# Altium schematic sheet Sheet1.SchDoc
size A4
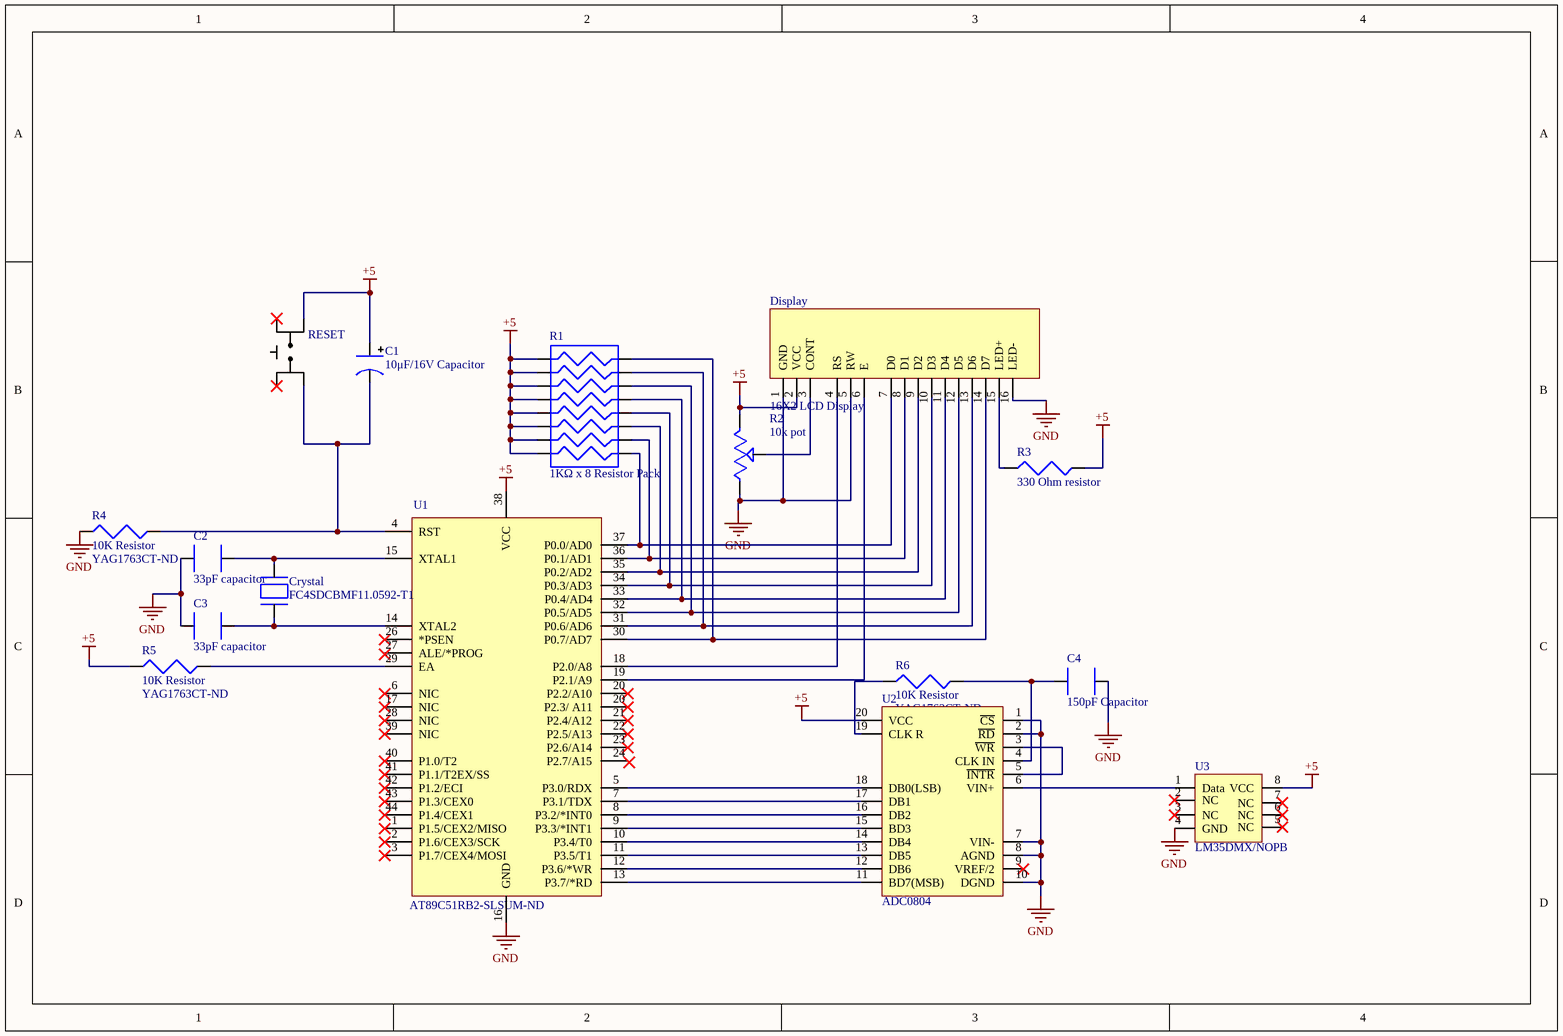
[diagram p0: Sheet1.SchDoc]

## Parts
C1  10μF/16V Capacitor  [10µf/16v Capacitor]
C2  33pF capacitor  [33pF Capacitor]
C3  33pF capacitor  [33pF Capacitor]
C4  150pF Capacitor  [150pF Capacitor]
Crystal  FC4SDCBMF11.0592-T1  [Crystal 11.0592MHz]
Display  16X2 LCD Display  [16X2 LCD Display]
R1  1KΩ x 8 Resistor Pack  [1KO x 8 Resistor Pack]
R2  10k pot  [10k pot]
R3  330 Ohm resistor  [330O Resistor]
R4  10K Resistor  Supplier Part Number 1: YAG1763CT-ND  [10KO Resistor]
R5  10K Resistor  Supplier Part Number 1: YAG1763CT-ND  [10KO Resistor]
R6  10K Resistor  Supplier Part Number 1: YAG1763CT-ND  [10KO Resistor]
RESET  TL3305AF260QG  [Reset]  (value not drawn)
U1  Supplier Part Number 1: AT89C51RB2-SLSUM-ND  [AT89C51 (8051 Microcontroller)]  (hidden comment: AT89C51RB2-SLSUM)
U2  ADC0804  [ADC0804]
U3  LM35DMX/NOPB  [LM35DMX]

## Nets
+5: C1.1 Display.2(VCC) R1.1 R1.2 R1.3 R1.4 R1.5 R1.6 R1.7 R1.8 R2.2 R3.2 R5.1 RESET.3 U1.38(VCC) U2.20(VCC) U3.8(VCC)
GND: C2.1 C3.1 C4.2 Display.1(GND) Display.5(RW) Display.16(LED-) R2.1 R4.1 U1.16(GND) U2.1(~{CS}) U2.2(~{RD}) U2.7(VIN-) U2.8(AGND) U2.10(DGND) U3.4(GND)
NetC1_2: C1.2 R4.2 RESET.2 U1.4(RST)
NetC2_2: C2.2 Crystal.2 U1.15(XTAL1)
NetC3_2: C3.2 Crystal.1 U1.14(XTAL2)
NetC4_1: C4.1 R6.2 U2.4(CLK_IN)
NetDisplay_3: Display.3(CONT) R2.3
NetDisplay_4: Display.4(RS) U1.18(P2.0/A8)
NetDisplay_6: Display.6(E) U1.19(P2.1/A9)
NetDisplay_7: Display.7(D0) R1.9 U1.37(P0.0/AD0)
NetDisplay_8: Display.8(D1) R1.10 U1.36(P0.1/AD1)
NetDisplay_9: Display.9(D2) R1.11 U1.35(P0.2/AD2)
NetDisplay_10: Display.10(D3) R1.12 U1.34(P0.3/AD3)
NetDisplay_11: Display.11(D4) R1.13 U1.33(P0.4/AD4)
NetDisplay_12: Display.12(D5) R1.14 U1.32(P0.5/AD5)
NetDisplay_13: Display.13(D6) R1.15 U1.31(P0.6/AD6)
NetDisplay_14: Display.14(D7) R1.16 U1.30(P0.7/AD7)
NetDisplay_15: Display.15(LED+) R3.1
NetR5_2: R5.2 U1.29(EA)
NetR6_1: R6.1 U2.19(CLK_R)
NetU1_5: U1.5(P3.0/RDX) U2.18(DB0(LSB))
NetU1_7: U1.7(P3.1/TDX) U2.17(DB1)
NetU1_8: U1.8(P3.2/*INT0) U2.16(DB2)
NetU1_9: U1.9(P3.3/*INT1) U2.15(BD3)
NetU1_10: U1.10(P3.4/T0) U2.14(DB4)
NetU1_11: U1.11(P3.5/T1) U2.13(DB5)
NetU1_12: U1.12(P3.6/*WR) U2.12(DB6)
NetU1_13: U1.13(P3.7/*RD) U2.11(BD7(MSB))
NetU2_3: U2.3(~{WR}) U2.5(~{INTR})
NetU2_6: U2.6(VIN+) U3.1(Data)

Not connected (* = marked no-connect by the designer): RESET 1* 4*; U1 1(P1.5/CEX2/MISO)* 2(P1.6/CEX3/SCK)* 3(P1.7/CEX4/MOSI)* 6(NIC)* 17(NIC)* 20(P2.2/A10)* 21(P2.4/A12)* 22(P2.5/A13)* 23(P2.6/A14)* 24(P2.7/A15) 26(*PSEN)* 27(ALE/*PROG) 28(NIC)* 39(NIC)* 40(P1.0/T2)* 41(P1.1/T2EX/SS)* 42(P1.2/ECI)* 43(P1.3/CEX0)* 44(P1.4/CEX1)*; U2 9(VREF/2)*; U3 2(NC)* 3(NC)* 5(NC)* 6(NC)* 7(NC)*

## Library data of the parts
C1 = 10μF/16V Capacitor: Multilayer Ceramic Capacitors MLCC - SMD/SMT 10uF 16V X5R 10%; Manufacturer: Yageo; Manufacturer Part Number: CC0805KKX5R7BB106; Supplier 1: Digi-Key; RoHS: Yes; Category: Ceramic Capacitors; Stock 1: 725165; Pricing 1: 1=0.40000, 10=0.27500, 50=0.19240, 100=0.16500, 500=0.12376, 1000=0.10450 (USD); Mount: Surface Mount; Case/Package: 0805; Case Code (Imperial): 0805; Case Code (Metric): 2012; Weight: 0.000194oz; Min Operating Temperature: -55°C; Max Operating Temperature: 85°C; Capacitance: 10uF; Tolerance: 10%; Dielectric: X5R; Voltage Rating (DC): 16V; Packaging: Tape and Reel; Voltage Rating: 16V; Termination: SMD/SMT; Resistor Type: Ceramic; Series: CC; Construction: Flat; Length: 2mm; Width: 0.049inch; Height: 1.25mm; Thickness: 0.057inch; Depth: 1.25mm; Radiation Hardening: No; Lead Free: Lead Free; Halogen Free: Halogen Free; RoHS Compliant: Yes; ComponentLink1URL: https://datasheet.ciiva.com/17434/upy-gphc-x5r-4v-to-50v-12-17434747.pdf?src-supplier=Avnet+Europe; ComponentLink1Description: https://datasheet.ciiva.com/17434/upy-gphc-x5r-4v-to-50v-12-17434747.pdf?src-supplier=Avnet+Europe; Supplier Part Number 1: 311-1865-1-ND
C2 C3 = smd 33pF capacitor: Cap Ceramic 33pF 50V C0G 5% SMD 0402 125C Paper T/R; Manufacturer: Samsung; Manufacturer Part Number: CL05C330JB5NNNC; Temperature Coefficient: 300ppm/°C; Supplier 1: Digi-Key; RoHS: Yes; Category: Ceramic Capacitors; Stock 1: 8625103; Pricing 1: 1=0.10000, 10=0.02500, 50=0.01360, 100=0.01120, 500=0.00796, 1000=0.00626, 2500=0.00569, 5000=0.00524 (USD); Mount: Surface Mount; Case/Package: 0402; Case Code (Metric): 1005; Case Code (Imperial): 0402; Material: Ceramic; Contact Plating: Tin; Min Operating Temperature: -55°C; Max Operating Temperature: 125°C; Package Quantity: 1; Packaging: Tape and Reel; Capacitance: 33pF; Tolerance: 5%; Voltage Rating: 50V; Dielectric: C0G; Voltage: 50V; Voltage Rating (DC): 50V; Series: CL; Construction: Flat; Length: 1mm; Width: 0.02inch; Height: 0.5mm; Thickness: 0.022inch; Depth: 0.5mm; Radiation Hardening: No; Lead Free: Lead Free; RoHS Compliant: Yes; ComponentLink1URL: https://datasheet.ciiva.com/15195/getdatasheetpartid-355282-15195687.pdf?src-supplier=Verical; ComponentLink1Description: https://datasheet.ciiva.com/15195/getdatasheetpartid-355282-15195687.pdf?src-supplier=Verical; ComponentLink2URL: https://datasheet.ciiva.com/29198/458594-da-01-en-vs-kondensator-0402-29198402.pdf?src-supplier=Conrad; ComponentLink2Description: https://datasheet.ciiva.com/29198/458594-da-01-en-vs-kondensator-0402-29198402.pdf?src-supplier=Conrad; Supplier Part Number 1: 1276-1272-1-ND
C4 = 150pF Capacitor: CAP CER 150PF 250V NPO 0603; Manufacturer: Yageo; Manufacturer Part Number: AC0603JRNPOYBN151; Supplier 1: Digi-Key; RoHS: Yes; Stock 1: 20564; Pricing 1: 1=0.20000, 10=0.13300, 50=0.07980, 100=0.06740, 500=0.04610, 1000=0.04078 (USD); RoHS Compliant: Yes; ComponentLink1URL: http://www.yageo.com/NewPortal/_en/search/productDocs.jsp?YageoPartNumber=AC0603JRNPOYBN151&src-supplier=Digi-Key; ComponentLink1Description: http://www.yageo.com/NewPortal/_en/search/productDocs.jsp?YageoPartNumber=AC0603JRNPOYBN151&src-supplier=Digi-Key; Supplier Part Number 1: 311-3283-1-ND
Crystal = FC4SDCBMF11.0592-T1: Crystal 11.0592MHz ±30ppm (Tol) ±50ppm (Stability) 20pF FUND 60Ohm 2-Pin HC-49/SDLF SMD T/R; Manufacturer: Fox Electronics; Supplier 1: Digi-Key; Manufacturer Part Number: FC4SDCBMF11.0592-T1; RoHS: Yes; Stock 1: 29569; Pricing 1: 1=0.29000, 10=0.23900, 50=0.21500, 100=0.19110, 500=0.18154 (USD); ComponentLink1URL: http://www.foxonline.com/pdfs/C4SD.pdf?src-supplier=Digi-Key; ComponentLink1Description: http://www.foxonline.com/pdfs/C4SD.pdf?src-supplier=Digi-Key; Supplier Part Number 1: 631-1012-1-ND
Display = 16X2 LCD Display: LCD Graphic Display Modules & Accessories FSTN (+) 80.0 x 36.0; Manufacturer: Newhaven Display; Manufacturer Part Number: NHD-14432WG-BTFH-V#T; Background Color: White; Resolution (height): 32pixel; Resolution (width): 144pixel; Backlight Type: LED; Interface: Parallel; Supplier 1: Digi-Key; RoHS: No; Category: LCD, OLED, Graphic Displays; Stock 1: 163; Pricing 1: 1=18.55000, 5=17.43200, 10=16.56400 (USD); Min Operating Temperature: -20°C; Max Operating Temperature: 70°C; Packaging: Bulk; Package Quantity: 100; ComponentLink1URL: https://datasheet.ciiva.com/5326/nhd-14432wg-btfh-vt-17058-5326579.pdf?src-supplier=Mouser; ComponentLink1Description: https://datasheet.ciiva.com/5326/nhd-14432wg-btfh-vt-17058-5326579.pdf?src-supplier=Mouser; ComponentLink2URL: https://datasheet.ciiva.com/15047/nhd-14432wg-btfh-vt-15047133.pdf?src-supplier=Digi-Key; ComponentLink2Description: https://datasheet.ciiva.com/15047/nhd-14432wg-btfh-vt-15047133.pdf?src-supplier=Digi-Key; Supplier Part Number 1: NHD-14432WG-BTFH-V#T-ND
R1 = 1KΩ x 8 Resistor Pack: RES ARRAY 8 RES 1K OHM 16SOIC; Manufacturer: Vishay Dale Thin Film; Manufacturer Part Number: NOMCT16031001AT1; Number of Terminals/Pins: 16; Voltage Rating: 100V; Resistance: 1kR; Tolerance: 0.1%; Circuit Type: Isolated; Number of Resistors: 8; Power Per Element: 100mW; Temperature Coefficient: 25ppm/°C; Supplier 1: Digi-Key; RoHS: Yes; Category: Resistor Arrays; Stock 1: 8459; Pricing 1: 1=4.16000, 10=3.76000, 25=3.44000, 50=3.20000, 100=2.80000, 250=2.40000, 500=2.20000 (USD); Mount: Surface Mount; Case/Package: SOIC; Number of Pins: 16; Contact Plating: Tin,Matte; Min Operating Temperature: -55°C; Max Operating Temperature: 125°C; Package Quantity: 1; Packaging: Tape and Reel; Termination: SMD/SMT; Power Rating: 100mW; Series: NOMC; Length: 9.906mm; Width: 0.154inch; Height: 0.063inch; Lead Pitch: 1.27mm; Terminal Pitch: 1.27mm; Lead Free: Lead Free; RoHS Compliant: Yes; ComponentLink1URL: https://datasheet.ciiva.com/2692/nomc-2692947.pdf?src-supplier=Digi-Key; ComponentLink1Description: https://datasheet.ciiva.com/2692/nomc-2692947.pdf?src-supplier=Digi-Key; ComponentLink2URL: https://datasheet.ciiva.com/2692/nomc-2692948.pdf?src-supplier=Digi-Key; ComponentLink2Description: https://datasheet.ciiva.com/2692/nomc-2692948.pdf?src-supplier=Digi-Key; ComponentLink3URL: https://datasheet.ciiva.com/2692/nomc-2692949.pdf?src-supplier=Digi-Key; ComponentLink3Description: https://datasheet.ciiva.com/2692/nomc-2692949.pdf?src-supplier=Digi-Key; Supplier Part Number 1: NOMCT16-1KACT-ND
R2 = 10k pot: Res POT 10K Ohm 20% 1/20W 1(Elec)/1(Mech)Turn 6mm (25.7 X 12.1 X 14.85mm) Pin Panel Mount/Bracket Mount Tray; Manufacturer: Alps Electric; Manufacturer Part Number: RK09L1120A2S; Resistance: 10kR; Power Rating: 50mW; Number of Turns: 1; Hole Diameter: 9mm; Supplier 1: Mouser; RoHS: Yes; Category: Variable Resistors and Potentiometers; Stock 1: 3989; Pricing 1: 1=1.38000, 10=1.38000, 50=1.14000, 100=1.10000, 1000=0.99900, 10000=0.95000 (USD); Mount: Panel,Brackets,Through Hole; Min Operating Temperature: -10°C; Max Operating Temperature: 70°C; Tolerance: 20%; Type: Potentiometer; Packaging: Tray; Package Quantity: 2000; Resistor Type: Potentiometer; Termination: Pin; Series: RK09L; Length: 25.7mm; Depth: 12.1mm; Radiation Hardening: No; Military Standard: Not; Lead Free: Lead Free; RoHS Compliant: Yes; ComponentLink1URL: https://datasheet.ciiva.com/15764/rk09l-15764032.pdf?src-supplier=Onlinecomponents.com; ComponentLink1Description: https://datasheet.ciiva.com/15764/rk09l-15764032.pdf?src-supplier=Onlinecomponents.com; ComponentLink2URL: https://datasheet.ciiva.com/11830/0900766b80f4c570-11830918.pdf?src-supplier=RSComponents; ComponentLink2Description: https://datasheet.ciiva.com/11830/0900766b80f4c570-11830918.pdf?src-supplier=RSComponents; Supplier Part Number 1: 688-RK09L1120A2S
R3 = 0805SMD 330resistor: YAGEO   RC0805JR-07330RL   THICK FILM RESISTOR, 330 OHM, 125mW, 5%, FULL REEL; Manufacturer Part Number: RL0805FR-7W0R33L; Resistance: 330mR; Tolerance: 1%; Voltage Rating: 150V; Temperature Coefficient: 600ppm/°C; Max Power Dissipation: 250mW; Supplier 1: Digi-Key; Manufacturer: Yageo; RoHS: Yes; Category: Chip SMD Resistors; Stock 1: 7620; Pricing 1: 1=0.42000, 10=0.32300, 100=0.13570, 1000=0.07490, 2500=0.07022 (USD); Case/Package: 0805; Case Code (Imperial): 0805; Case Code (Metric): 2012; Weight: 0.000194oz; Min Operating Temperature: -55°C; Max Operating Temperature: 125°C; Packaging: Tape and Reel; Power Rating: 125mW; Resistor Type: Thick Film; Termination: SMD/SMT; Package Quantity: 5000; Features: Moisture Resistant,Automotive AEC-Q200; Series: RL; Number of Terminations: 2; Technology: THICK FILM; Construction: Rectangular; Resistance Tolerance: 1%; Length: 2mm; Width: 1.25mm; Height: 0.5mm; Depth: 1.25mm; REACH SVHC: Unknown; Military Standard: Not; Lead Free: Lead Free; RoHS Compliant: Yes; ComponentLink1URL: https://datasheet.ciiva.com/14972/rl20high20power20series-14972688.pdf?src-supplier=Digi-Key; ComponentLink1Description: https://datasheet.ciiva.com/14972/rl20high20power20series-14972688.pdf?src-supplier=Digi-Key; ComponentLink2URL: https://datasheet.ciiva.com/7942/1693483-7942062.pdf?src-supplier=Element14; ComponentLink2Description: https://datasheet.ciiva.com/7942/1693483-7942062.pdf?src-supplier=Element14; ComponentLink3URL: https://datasheet.ciiva.com/7942/1693483-7942063.pdf?src-supplier=Element14; ComponentLink3Description: https://datasheet.ciiva.com/7942/1693483-7942063.pdf?src-supplier=Element14; Supplier Part Number 1: 311-.33LUCT-ND; Supplier 2: Digi-Key; Stock 2: 1073130; Pricing 2: 1=0.10000, 10=0.03100, 100=0.01260, 1000=0.00567, 2500=0.00492 (USD); Contact Plating: Tin,Matte,Lead; Size Code: 0805; Radiation Hardening: No; ComponentLink4URL: https://datasheet.ciiva.com/17008/rc0805-17008395.pdf?src-supplier=Future+Electronics; ComponentLink4Description: https://datasheet.ciiva.com/17008/rc0805-17008395.pdf?src-supplier=Future+Electronics; ComponentLink5URL: https://datasheet.ciiva.com/46395/444164-46395119.pdf?src-supplier=Element14; ComponentLink5Description: https://datasheet.ciiva.com/46395/444164-46395119.pdf?src-supplier=Element14; ComponentLink6URL: https://datasheet.ciiva.com/7941/442941-7941941.pdf?src-supplier=Element14; ComponentLink6Description: https://datasheet.ciiva.com/7941/442941-7941941.pdf?src-supplier=Element14; ComponentLink7URL: https://datasheet.ciiva.com/7941/442941-7941942.pdf?src-supplier=Element14; ComponentLink7Description: https://datasheet.ciiva.com/7941/442941-7941942.pdf?src-supplier=Element14; ComponentLink8URL: https://datasheet.ciiva.com/12555/rc0805-257173-12555078.pdf?src-supplier=Mouser; ComponentLink8Description: https://datasheet.ciiva.com/12555/rc0805-257173-12555078.pdf?src-supplier=Mouser; Supplier Part Number 2: 311-330ARCT-ND
R4-R6 = 0805 SMD 10k resistor: Supplier 1: Digi-Key
RESET = TL3305AF260QG: Tactile Switches 6mm SMT Gull Wing 5mm Act Height; Manufacturer: E-Switch; Mechanical Life: 200000Cycles; Throw Configuration: SPST; Illumination Type: Non-Illuminated; Operating Force: 260gf; Switch Function: Off-Mom; Actuator Type: Standard; Switch Travel: 0.2mm; Actuator Material: Nylon,Polyamide; Voltage Rating (DC): 12V; Current Rating: 50mA; Contact Resistance: 100mR; Max Voltage Rating (DC): 50V; Electrical Life: 100000Cycles; Actuator Length: 1.4mm; Supplier 1: Digi-Key; Manufacturer Part Number: TL3305AF260QG; RoHS: No; Category: Tactile Switches; Stock 1: 78497; Pricing 1: 1=0.18000, 10=0.17700, 25=0.16760, 100=0.15250, 250=0.14336, 500=0.13116, 1000=0.10980 (USD); Mount: Surface Mount; Min Operating Temperature: -20°C; Max Operating Temperature: 70°C; Packaging: Tape and Reel; Termination: Gull Wing; Lead Free: Lead Free; ComponentLink1URL: http://www.farnell.com/datasheets/2554191.pdf?src-supplier=Farnell; ComponentLink1Description: http://www.farnell.com/datasheets/2554191.pdf?src-supplier=Farnell; ComponentLink2URL: http://spec_sheets.e-switch.com/specs/P010471.pdf?src-supplier=Mouser; ComponentLink2Description: http://spec_sheets.e-switch.com/specs/P010471.pdf?src-supplier=Mouser; ComponentLink3URL: http://www.farnell.com/datasheets/2554191.pdf?src-supplier=Newark; ComponentLink3Description: http://www.farnell.com/datasheets/2554191.pdf?src-supplier=Newark; ComponentLink4URL: http://www.farnell.com/datasheets/2554191.pdf?src-supplier=Element14; ComponentLink4Description: http://www.farnell.com/datasheets/2554191.pdf?src-supplier=Element14; ComponentLink5URL: http://spec_sheets.e-switch.com/specs/P010471.pdf?src-supplier=Digi-Key; ComponentLink5Description: http://spec_sheets.e-switch.com/specs/P010471.pdf?src-supplier=Digi-Key; ComponentLink6URL: http://spec_sheets.e-switch.com/specs/P010471.pdf?src-supplier=NAC+Semi; ComponentLink6Description: http://spec_sheets.e-switch.com/specs/P010471.pdf?src-supplier=NAC+Semi; Supplier Part Number 1: EG5353CT-ND; Supplier 2: Digi-Key; Stock 2: 51540; Pricing 2: 1=0.36000, 10=0.34800, 25=0.32760, 100=0.28440, 250=0.25800, 500=0.24000 (USD); Contact Plating: Silver; Contact Material: Silver; Package Quantity: 1000; Orientation: Straight; Series: TL3301; Voltage Rating: 50V; Insulation Resistance: 100MR; RoHS Compliant: Yes; REACH SVHC: No SVHC; ComponentLink7URL: https://datasheet.ciiva.com/2900/p010516d-2900775.pdf?src-supplier=Digi-Key; ComponentLink7Description: https://datasheet.ciiva.com/2900/p010516d-2900775.pdf?src-supplier=Digi-Key; ComponentLink8URL: https://datasheet.ciiva.com/7637/tl3301-7637656.pdf?src-supplier=Element14; ComponentLink8Description: https://datasheet.ciiva.com/7637/tl3301-7637656.pdf?src-supplier=Element14; ComponentLink9URL: https://datasheet.ciiva.com/2900/tl3301-2900776.pdf?src-supplier=Digi-Key; ComponentLink9Description: https://datasheet.ciiva.com/2900/tl3301-2900776.pdf?src-supplier=Digi-Key; Supplier Part Number 2: EG2526CT-ND
U1 = AT89C51RB2-SLSUM: MCU 8-bit AT89 80C51 CISC 32KB Flash 3.3V/5V 44-Pin VQFP Tray; Manufacturer: Microchip / Atmel; Core Architecture: 8051; Interface: SPI,UART,USART; Peripherals: POR,PWM,WDT; RAM Size: 1.25KB; Max Power Dissipation: 1W; Number of I/Os: 32; Number of Timers/Counters: 3; Watchdog Timer: Yes; Max Supply Voltage: 5.5V; Min Supply Voltage: 2.7V; Frequency: 60MHz; Memory Size: 16KB; Oscillator Type: External; Data Bus Width: 8b; Access Time: 60us; Supplier 1: Digi-Key; Manufacturer Part Number: AT89C51RB2-SLSUM; RoHS: Yes; Category: Microcontrollers; Stock 1: 4189; Pricing 1: 1=5.21000, 25=4.78000, 100=4.33000 (USD); Mount: Surface Mount; Case/Package: PLCC; Number of Pins: 44; Contact Plating: Tin,Matte; Min Operating Temperature: -40°C; Max Operating Temperature: 85°C; Package Quantity: 972; Packaging: Rail/Tube; Memory Type: FLASH; Number of Programmable I/O: 32; Max Frequency: 60MHz; Address Bus Width: 8b; Radiation Hardening: No; Lead Free: Lead Free; REACH SVHC: No SVHC; ComponentLink1URL: https://datasheet.ciiva.com/15122/getdatasheetpartid-81444-15122117.pdf?src-supplier=Verical; ComponentLink1Description: https://datasheet.ciiva.com/15122/getdatasheetpartid-81444-15122117.pdf?src-supplier=Verical; ComponentLink2URL: https://datasheet.ciiva.com/26820/at89c51rb2-slsum-26820400.pdf?src-supplier=IIIC; ComponentLink2Description: https://datasheet.ciiva.com/26820/at89c51rb2-slsum-26820400.pdf?src-supplier=IIIC; ComponentLink3URL: https://datasheet.ciiva.com/24153/doc4180-24153718.pdf?src-supplier=Future+Electronics; ComponentLink3Description: https://datasheet.ciiva.com/24153/doc4180-24153718.pdf?src-supplier=Future+Electronics; ComponentLink4URL: https://datasheet.ciiva.com/3203/doc4180-3203035.pdf?src-supplier=Avnet; ComponentLink4Description: https://datasheet.ciiva.com/3203/doc4180-3203035.pdf?src-supplier=Avnet; ComponentLink5URL: https://datasheet.ciiva.com/22640/1626853-22640219.pdf?src-supplier=Element14; ComponentLink5Description: https://datasheet.ciiva.com/22640/1626853-22640219.pdf?src-supplier=Element14; Stock 2: 1379; Pricing 2: 1=5.95000, 25=5.46000, 100=4.95000 (USD); Series: 89C; RoHS Compliant: Yes; ComponentLink6URL: https://datasheet.ciiva.com/22640/1626853-22640224.pdf?src-supplier=Element14; ComponentLink6Description: https://datasheet.ciiva.com/22640/1626853-22640224.pdf?src-supplier=Element14; ComponentLink7URL: https://datasheet.ciiva.com/26820/at89c51rc2-rltum-26820404.pdf?src-supplier=IIIC; ComponentLink7Description: https://datasheet.ciiva.com/26820/at89c51rc2-rltum-26820404.pdf?src-supplier=IIIC; ComponentLink8URL: https://datasheet.ciiva.com/26207/doc4180-26207493.pdf?src-supplier=Avnet+Europe; ComponentLink8Description: https://datasheet.ciiva.com/26207/doc4180-26207493.pdf?src-supplier=Avnet+Europe; ComponentLink9URL: https://datasheet.ciiva.com/9233/doc4180-9233990.pdf?src-supplier=Avnet; ComponentLink9Description: https://datasheet.ciiva.com/9233/doc4180-9233990.pdf?src-supplier=Avnet; ComponentLink10URL: https://datasheet.ciiva.com/6656/doc4180-6656425.pdf?src-supplier=Digi-Key; ComponentLink10Description: https://datasheet.ciiva.com/6656/doc4180-6656425.pdf?src-supplier=Digi-Key
U2 = ADC0804: TEXAS INSTRUMENTS         ADC0804LCWM/NOPB            ANALOG TO DIGITAL CONVERTER ADC, 8 BIT, 9.708kSPS, SOIC-20; Manufacturer: TI National Semiconductor; Resolution: 8b; Sampling Rate: 10KS/s; Number of Analog Inputs: 1; Polarity: Unipolar; Operating Supply Voltage: 5V; Max Power Dissipation: 875mW; Min Supply Voltage: 4.5V; Max Supply Voltage: 6.3V; Interface: Parallel; Number of Bits: 8; Supply Type: Single; Power Consumption: 5.5mW; Supplier 1: Digi-Key; Manufacturer Part Number: ADC0804LCWM/NOPB; RoHS: Yes; Category: Analog to Digital Converters (ADCs); Stock 1: 3151; Pricing 1: 1=4.74000, 10=4.25800, 25=4.02600, 100=3.31020, 250=2.97020, 500=2.86284, 1000=2.37974, 2500=2.29028, 5000=2.27880 (USD); Mount: Surface Mount; Case/Package: SOIC; Number of Pins: 20; Min Operating Temperature: 0°C; Max Operating Temperature: 70°C; Package Quantity: 36; Number of Channels: 1; Packaging: Rail/Tube; Number of Converters: 1; Number of A/D Converters: 1; Number of Elements: 1; Power Dissipation: 875mW; Conversion Rate: 10KS/s; Number of Inputs: 1; Length: 12.8mm; Width: 7.47mm; Height: 2.34mm; Radiation Hardening: No; REACH SVHC: No SVHC; Lead Free: Lead Free; ComponentLink1URL: https://datasheet.ciiva.com/27051/1251291-27051770.pdf?src-supplier=Jameco; ComponentLink1Description: https://datasheet.ciiva.com/27051/1251291-27051770.pdf?src-supplier=Jameco; ComponentLink2URL: https://datasheet.ciiva.com/25993/adc0804-n-25993733.pdf?src-supplier=Avnet+Europe; ComponentLink2Description: https://datasheet.ciiva.com/25993/adc0804-n-25993733.pdf?src-supplier=Avnet+Europe; ComponentLink3URL: https://datasheet.ciiva.com/1275/adc0804-n-1275641.pdf?src-supplier=Digi-Key; ComponentLink3Description: https://datasheet.ciiva.com/1275/adc0804-n-1275641.pdf?src-supplier=Digi-Key; ComponentLink4URL: https://datasheet.ciiva.com/3037/adc0804-n-3037867.pdf?src-supplier=Avnet; ComponentLink4Description: https://datasheet.ciiva.com/3037/adc0804-n-3037867.pdf?src-supplier=Avnet; ComponentLink5URL: https://datasheet.ciiva.com/7988/1837602-7988877.pdf?src-supplier=Element14; ComponentLink5Description: https://datasheet.ciiva.com/7988/1837602-7988877.pdf?src-supplier=Element14; ComponentLink6URL: https://datasheet.ciiva.com/48707/001047394-da-01-en-ic-adc-comp-adc0804lcwm-nopb-soic-20-tid-48707530.pdf?src-supplier=Conrad; ComponentLink6Description: https://datasheet.ciiva.com/48707/001047394-da-01-en-ic-adc-comp-adc0804lcwm-nopb-soic-20-tid-48707530.pdf?src-supplier=Conrad; Supplier Part Number 1: ADC0804LCWM/NOPB-ND
U3 = LM35DMX/NOPB: SENSOR ANALOG 0C-100C 8SOIC; Manufacturer: TI National Semiconductor; Output Type: Analog Voltage,Analog; Min Supply Voltage: 4V; Max Supply Voltage: 30V; Quiescent Current: 56uA; Output Current: 10mA; Operating Supply Current: 91.5uA; Supplier 1: Digi-Key; Manufacturer Part Number: LM35DMX/NOPB; RoHS: Yes; Category: Temperature and Humidity Sensors; Stock 1: 11817; Pricing 1: 1=1.99000, 5=1.88000, 10=1.61100, 25=1.28880, 50=1.18140, 100=1.07400, 500=0.93976, 1000=0.83235 (USD); Mount: Surface Mount; Case/Package: SOIC; Number of Pins: 8; Contact Plating: Tin; Min Operating Temperature: -40°C; Max Operating Temperature: 110°C; Interface: Analog; Packaging: Tape and Reel; Package Quantity: 2500; Series: LM35; Max Supply Voltage (DC): 30V; Min Supply Voltage (DC): 4V; Radiation Hardening: No; Lead Free: Lead Free; RoHS Compliant: Yes; REACH SVHC: No SVHC; ComponentLink1URL: https://datasheet.ciiva.com/15098/getdatasheetpartid-663045-15098167.pdf?src-supplier=Verical; ComponentLink1Description: https://datasheet.ciiva.com/15098/getdatasheetpartid-663045-15098167.pdf?src-supplier=Verical; ComponentLink2URL: https://datasheet.ciiva.com/46417/1837589-46417013.pdf?src-supplier=Element14; ComponentLink2Description: https://datasheet.ciiva.com/46417/1837589-46417013.pdf?src-supplier=Element14; ComponentLink3URL: https://datasheet.ciiva.com/3277/lm35-3277911.pdf?src-supplier=Avnet; ComponentLink3Description: https://datasheet.ciiva.com/3277/lm35-3277911.pdf?src-supplier=Avnet; ComponentLink4URL: https://datasheet.ciiva.com/6476/lm35-6476191.pdf?src-supplier=Digi-Key; ComponentLink4Description: https://datasheet.ciiva.com/6476/lm35-6476191.pdf?src-supplier=Digi-Key; Supplier Part Number 1: LM35DMX/NOPBCT-ND